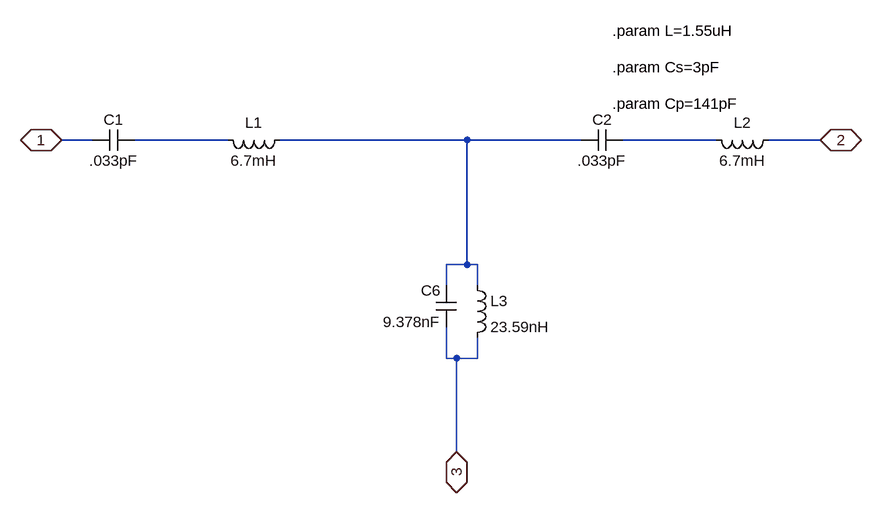
[diagram p0: schematic Ceramic_Filter_v1_10704_kHz_600_Ohms.asc]
Ceramic_Filter_v1_10704_kHz_600_Ohms.asc, the LTspice schematic file:
Version 4.1
SHEET 1 1308 680
WIRE -32 112 -80 112
WIRE 176 112 32 112
WIRE 544 112 256 112
WIRE 720 112 544 112
WIRE 928 112 784 112
WIRE 1088 112 1008 112
WIRE 544 304 544 112
WIRE 544 304 512 304
WIRE 560 304 544 304
WIRE 512 336 512 304
WIRE 560 336 560 304
WIRE 512 448 512 400
WIRE 528 448 512 448
WIRE 560 448 560 416
WIRE 560 448 528 448
WIRE 528 592 528 448
FLAG -80 112 1
IOPIN -80 112 BiDir
FLAG 1088 112 2
IOPIN 1088 112 BiDir
FLAG 528 592 3
IOPIN 528 592 BiDir
SYMBOL cap 32 96 R90
WINDOW 0 0 32 VBottom 2
WINDOW 3 32 32 VTop 2
SYMATTR InstName C1
SYMATTR Value .033pF
SYMBOL ind 544 320 R0
SYMATTR InstName L3
SYMATTR Value 23.59nH
SYMBOL cap 528 400 R180
WINDOW 0 24 56 Left 2
WINDOW 3 24 8 Left 2
SYMATTR InstName C6
SYMATTR Value 9.378nF
SYMBOL ind 272 96 R90
WINDOW 0 5 56 VBottom 2
WINDOW 3 32 56 VTop 2
SYMATTR InstName L1
SYMATTR Value 6.7mH
SYMBOL cap 784 96 R90
WINDOW 0 0 32 VBottom 2
WINDOW 3 32 32 VTop 2
SYMATTR InstName C2
SYMATTR Value .033pF
SYMBOL ind 1024 96 R90
WINDOW 0 5 56 VBottom 2
WINDOW 3 32 56 VTop 2
SYMATTR InstName L2
SYMATTR Value 6.7mH
TEXT 768 0 Left 2 !.param Cs=3pF
TEXT 768 -56 Left 2 !.param L=1.55uH
TEXT 768 56 Left 2 !.param Cp=141pF

The netlist it stands for:
* Ceramic_Filter_v1_10704_kHz_600_Ohms.asc
C1 N001 1 .033pF
L3 N002 3 23.59nH
C6 3 N002 9.378nF
L1 N002 N001 6.7mH
C2 N003 N002 .033pF
L2 2 N003 6.7mH
.param Cs=3pF
.param L=1.55uH
.param Cp=141pF
.backanno
.end